# Altium schematic sheet 12Vto5V_3A.SchDoc
size A4
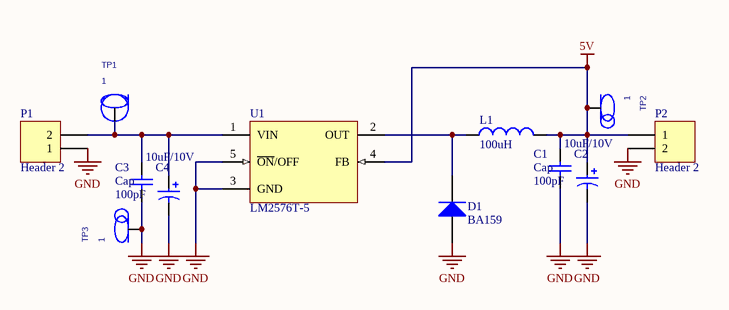
[diagram p0: 12Vto5V_3A.SchDoc]

## Parts
C1  Cap  value 100pF  [CAPR2.54-5.1x3.2]
C2  10uF/10V  [ECAP]
C3  Cap  value 100pF  [CAPR2.54-5.1x3.2]
C4  10uF/10V  [ECAP]
D1  BA159  [DIO7.1-3.9x1.9]
L1  value 100uH  [DRW9X12]  (hidden comment: Inductor)
P1  Header 2  [HDR1X2]
P2  Header 2  [HDR1X2]
TP1  1  [itp]
TP2  1  [itp]
TP3  1  [itp]
U1  LM2576T-5  [TO220_5]

## Nets
5V: C1.2 C2.1 L1.2 P2.1 TP2.1 U1.4(FB)
GND: C1.1 C2.2 C3.1 C4.2 D1.1(A) P1.1 P2.2 TP3.1 U1.3(GND) U1.5(~{ON}/OFF)
NetC3_2: C3.2 C4.1 P1.2 TP1.1 U1.1(VIN)
NetD1_2: D1.2(K) L1.1 U1.2(OUT)

## Library data of the parts
C1 C3 = Cap: Capacitor; Published: 8-Jun-2000; LatestRevisionDate: 17-Jul-2002; LatestRevisionNote: Re-released for DXP Platform.; PackageReference: RAD-0.3; Publisher: Altium Limited
C2 C4 = CAP2: Bi-Polar Capacitor; Value: 10uF/10V
D1 = Diode 1N914: High Conductance Fast Diode; Published: 8-Jun-2000; LatestRevisionDate: 17-Jul-2002; LatestRevisionNote: Re-released for DXP Platform.; DatasheetVersion: 1997; PackageReference: DO-35; Publisher: Altium Limited; Code_JEDEC: DO-204-AH; ComponentLink1Description: Manufacturer Link; ComponentLink1URL: http://www.fairchildsemi.com/; ComponentLink2Description: Datasheet; ComponentLink2URL: http://www.fairchildsemi.com/ds/1N%2F1N4448.pdf
P1 P2 = Header 2: Header, 2-Pin; LatestRevisionDate: 17-Jul-2002; LatestRevisionNote: Re-released for DXP Platform.; Publisher: Altium Limited
TP1-TP3 = TP: ROOM: CLOCK
U1 = LM2576T-ADJ: SIMPLE SWITCHER; 3A Step-Down Voltage Regulator; Manufacturer: National Semiconductor; PackageTopMarking: NSUZXYTT*LM2576T*-ADJ P+; PowerWise: N; Published: 4-Dec-2008; DatasheetVersion: Aug-2004; PackageVersion: revJ, Jan-1992; PackageReference: T05A; Publisher: Altium Limited; PackageDescription: TO-220, Molded, 5 Lead, Straight; CompType: Switcher; PartNumber: LM2576T-ADJ; RoHS: O; PinCount: 5; DigiKeyPartNumber: LM2576T-ADJNS-ND; Code_JEDEC: TO-220-AB; ComponentLink1Description: LM2576 Datasheet; ComponentLink1URL: http://www.national.com/ds/LM/LM2576.pdf; ComponentLink2Description: LM2576 Web Page; ComponentLink2URL: http://www.national.com/pf/LM/LM2576.html; ComponentLink3Description: T05A Package Page; ComponentLink3URL: http://www.national.com/packaging/folders/t05a.html
L1 = Inductor: Published: 8-Jun-2000; Revision: July-2002: Re-released for DXP Platform.; Publisher: Altium Limited